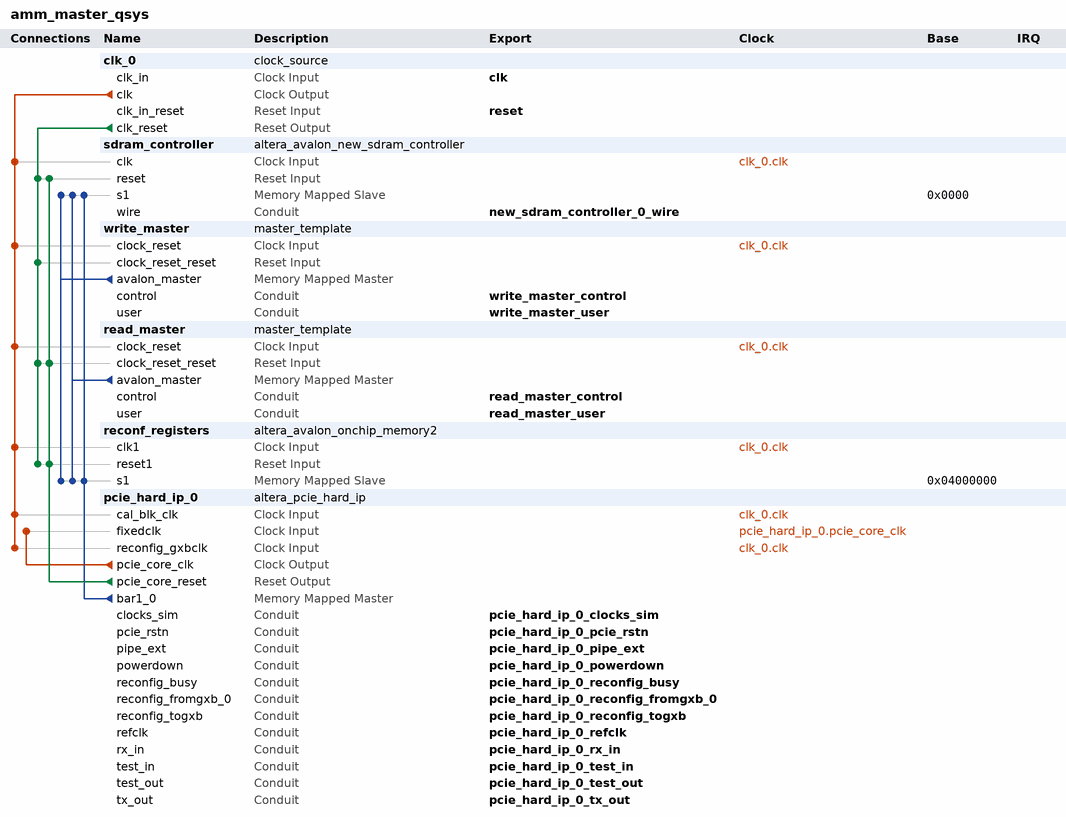
[diagram p0: system contents]
# Platform Designer (Qsys) system amm_master_qsys, Cyclone IV GX EP4CGX150DF31C7
# Parameters at their usual value, and those the tool derives, are not listed.
package require -exact qsys 13.0
create_system amm_master_qsys
set_project_property DEVICE_FAMILY {Cyclone IV GX}
set_project_property DEVICE EP4CGX150DF31C7

add_instance clk_0 clock_source 13.0
set_instance_parameter_value clk_0 clockFrequency 50000000

add_instance sdram_controller altera_avalon_new_sdram_controller 13.0.1.99.2
set_instance_parameter_value sdram_controller TAC 5.5
set_instance_parameter_value sdram_controller TRCD 20.0
set_instance_parameter_value sdram_controller TRP 20.0
set_instance_parameter_value sdram_controller casLatency 3
set_instance_parameter_value sdram_controller columnWidth 10
set_instance_parameter_value sdram_controller dataWidth 32
set_instance_parameter_value sdram_controller generateSimulationModel false
set_instance_parameter_value sdram_controller model single_Micron_MT48LC4M32B2_7_chip
set_instance_parameter_value sdram_controller numberOfBanks 4
set_instance_parameter_value sdram_controller numberOfChipSelects 1
set_instance_parameter_value sdram_controller powerUpDelay 100.0
set_instance_parameter_value sdram_controller refreshPeriod 15.625
set_instance_parameter_value sdram_controller rowWidth 12

add_instance write_master master_template 1.0
set_instance_parameter_value write_master MASTER_DIRECTION 1
set_instance_parameter_value write_master DATA_WIDTH 32
set_instance_parameter_value write_master ADDRESS_WIDTH 27
set_instance_parameter_value write_master BURST_CAPABLE 0
set_instance_parameter_value write_master MAXIMUM_BURST_COUNT 2
set_instance_parameter_value write_master FIFO_DEPTH 16
set_instance_parameter_value write_master MEMORY_BASED_FIFO 1

add_instance read_master master_template 1.0
set_instance_parameter_value read_master MASTER_DIRECTION 0
set_instance_parameter_value read_master DATA_WIDTH 32
set_instance_parameter_value read_master ADDRESS_WIDTH 27
set_instance_parameter_value read_master BURST_CAPABLE 0
set_instance_parameter_value read_master MAXIMUM_BURST_COUNT 2
set_instance_parameter_value read_master FIFO_DEPTH 32
set_instance_parameter_value read_master MEMORY_BASED_FIFO 1

add_instance reconf_registers altera_avalon_onchip_memory2 13.0.1.99.2
set_instance_parameter_value reconf_registers allowInSystemMemoryContentEditor true
set_instance_parameter_value reconf_registers dataWidth 32
set_instance_parameter_value reconf_registers dualPort false
set_instance_parameter_value reconf_registers initMemContent true
set_instance_parameter_value reconf_registers initializationFileName onchip_mem.hex
set_instance_parameter_value reconf_registers instanceID RCNF
set_instance_parameter_value reconf_registers memorySize 512
set_instance_parameter_value reconf_registers slave1Latency 2

add_instance pcie_hard_ip_0 altera_pcie_hard_ip 13.0
set_instance_parameter_value pcie_hard_ip_0 p_pcie_test_out_width 9bits
set_instance_parameter_value pcie_hard_ip_0 {BAR Type} {64 bit Prefetchable,Not used,Not used,Not used,Not used,Not used}
set_instance_parameter_value pcie_hard_ip_0 vendor_id 4466
set_instance_parameter_value pcie_hard_ip_0 device_id 57345
set_instance_parameter_value pcie_hard_ip_0 class_code 0
set_instance_parameter_value pcie_hard_ip_0 subsystem_vendor_id 4466
set_instance_parameter_value pcie_hard_ip_0 subsystem_device_id 4
set_instance_parameter_value pcie_hard_ip_0 my_advanced_errors false
set_instance_parameter_value pcie_hard_ip_0 my_enable_ecrc_check false
set_instance_parameter_value pcie_hard_ip_0 my_enable_ecrc_gen false
set_instance_parameter_value pcie_hard_ip_0 CG_NO_CPL_REORDERING 0
set_instance_parameter_value pcie_hard_ip_0 CG_ENABLE_A2P_INTERRUPT 0
set_instance_parameter_value pcie_hard_ip_0 CB_A2P_ADDR_MAP_PASS_THRU_BITS 28
set_instance_parameter_value pcie_hard_ip_0 {PCIe Address 63:32} 0x00000000,0x00000000,0x00000000,0x00000000,0x00000000,0x00000000,0x00000000,0x00000000,0x00000000,0x00000000,0x00000000,0x00000000,0x00000000,0x00000000,0x00000000,0x00000000
set_instance_parameter_value pcie_hard_ip_0 {PCIe Address 31:0} 0x00000000,0x00000000,0x00000000,0x00000000,0x00000000,0x00000000,0x00000000,0x00000000,0x00000000,0x00000000,0x00000000,0x00000000,0x00000000,0x00000000,0x00000000,0x00000000

# connections
add_connection clk_0.clk pcie_hard_ip_0.cal_blk_clk clock
add_connection clk_0.clk pcie_hard_ip_0.reconfig_gxbclk clock
add_connection clk_0.clk read_master.clock_reset clock
add_connection clk_0.clk reconf_registers.clk1 clock
add_connection clk_0.clk sdram_controller.clk clock
add_connection clk_0.clk write_master.clock_reset clock
add_connection pcie_hard_ip_0.pcie_core_clk pcie_hard_ip_0.fixedclk clock
add_connection clk_0.clk_reset read_master.clock_reset_reset reset
add_connection clk_0.clk_reset reconf_registers.reset1 reset
add_connection clk_0.clk_reset sdram_controller.reset reset
add_connection clk_0.clk_reset write_master.clock_reset_reset reset
add_connection pcie_hard_ip_0.pcie_core_reset read_master.clock_reset_reset reset
add_connection pcie_hard_ip_0.pcie_core_reset reconf_registers.reset1 reset
add_connection pcie_hard_ip_0.pcie_core_reset sdram_controller.reset reset
add_connection pcie_hard_ip_0.bar1_0 reconf_registers.s1 avalon
set_connection_parameter_value pcie_hard_ip_0.bar1_0/reconf_registers.s1 baseAddress 0x04000000
add_connection pcie_hard_ip_0.bar1_0 sdram_controller.s1 avalon
set_connection_parameter_value pcie_hard_ip_0.bar1_0/sdram_controller.s1 baseAddress 0x0000
add_connection read_master.avalon_master reconf_registers.s1 avalon
set_connection_parameter_value read_master.avalon_master/reconf_registers.s1 baseAddress 0x04000000
add_connection read_master.avalon_master sdram_controller.s1 avalon
set_connection_parameter_value read_master.avalon_master/sdram_controller.s1 baseAddress 0x0000
add_connection write_master.avalon_master reconf_registers.s1 avalon
set_connection_parameter_value write_master.avalon_master/reconf_registers.s1 baseAddress 0x04000000
add_connection write_master.avalon_master sdram_controller.s1 avalon
set_connection_parameter_value write_master.avalon_master/sdram_controller.s1 baseAddress 0x0000

# exported interfaces
add_interface clk clock sink
set_interface_property clk EXPORT_OF clk_0.clk_in
add_interface reset reset sink
set_interface_property reset EXPORT_OF clk_0.clk_in_reset
add_interface new_sdram_controller_0_wire conduit end
set_interface_property new_sdram_controller_0_wire EXPORT_OF sdram_controller.wire
add_interface write_master_control conduit end
set_interface_property write_master_control EXPORT_OF write_master.control
add_interface write_master_user conduit end
set_interface_property write_master_user EXPORT_OF write_master.user
add_interface read_master_control conduit end
set_interface_property read_master_control EXPORT_OF read_master.control
add_interface read_master_user conduit end
set_interface_property read_master_user EXPORT_OF read_master.user
add_interface pcie_hard_ip_0_refclk conduit end
set_interface_property pcie_hard_ip_0_refclk EXPORT_OF pcie_hard_ip_0.refclk
add_interface pcie_hard_ip_0_test_in conduit end
set_interface_property pcie_hard_ip_0_test_in EXPORT_OF pcie_hard_ip_0.test_in
add_interface pcie_hard_ip_0_pcie_rstn conduit end
set_interface_property pcie_hard_ip_0_pcie_rstn EXPORT_OF pcie_hard_ip_0.pcie_rstn
add_interface pcie_hard_ip_0_clocks_sim conduit end
set_interface_property pcie_hard_ip_0_clocks_sim EXPORT_OF pcie_hard_ip_0.clocks_sim
add_interface pcie_hard_ip_0_reconfig_busy conduit end
set_interface_property pcie_hard_ip_0_reconfig_busy EXPORT_OF pcie_hard_ip_0.reconfig_busy
add_interface pcie_hard_ip_0_pipe_ext conduit end
set_interface_property pcie_hard_ip_0_pipe_ext EXPORT_OF pcie_hard_ip_0.pipe_ext
add_interface pcie_hard_ip_0_powerdown conduit end
set_interface_property pcie_hard_ip_0_powerdown EXPORT_OF pcie_hard_ip_0.powerdown
add_interface pcie_hard_ip_0_rx_in conduit end
set_interface_property pcie_hard_ip_0_rx_in EXPORT_OF pcie_hard_ip_0.rx_in
add_interface pcie_hard_ip_0_tx_out conduit end
set_interface_property pcie_hard_ip_0_tx_out EXPORT_OF pcie_hard_ip_0.tx_out
add_interface pcie_hard_ip_0_reconfig_togxb conduit end
set_interface_property pcie_hard_ip_0_reconfig_togxb EXPORT_OF pcie_hard_ip_0.reconfig_togxb
add_interface pcie_hard_ip_0_reconfig_fromgxb_0 conduit end
set_interface_property pcie_hard_ip_0_reconfig_fromgxb_0 EXPORT_OF pcie_hard_ip_0.reconfig_fromgxb_0
add_interface pcie_hard_ip_0_test_out conduit end
set_interface_property pcie_hard_ip_0_test_out EXPORT_OF pcie_hard_ip_0.test_out

set_interconnect_requirement {$system} qsys_mm.clockCrossingAdapter HANDSHAKE
set_interconnect_requirement {$system} qsys_mm.maxAdditionalLatency 1

save_system amm_master_qsys.qsys
